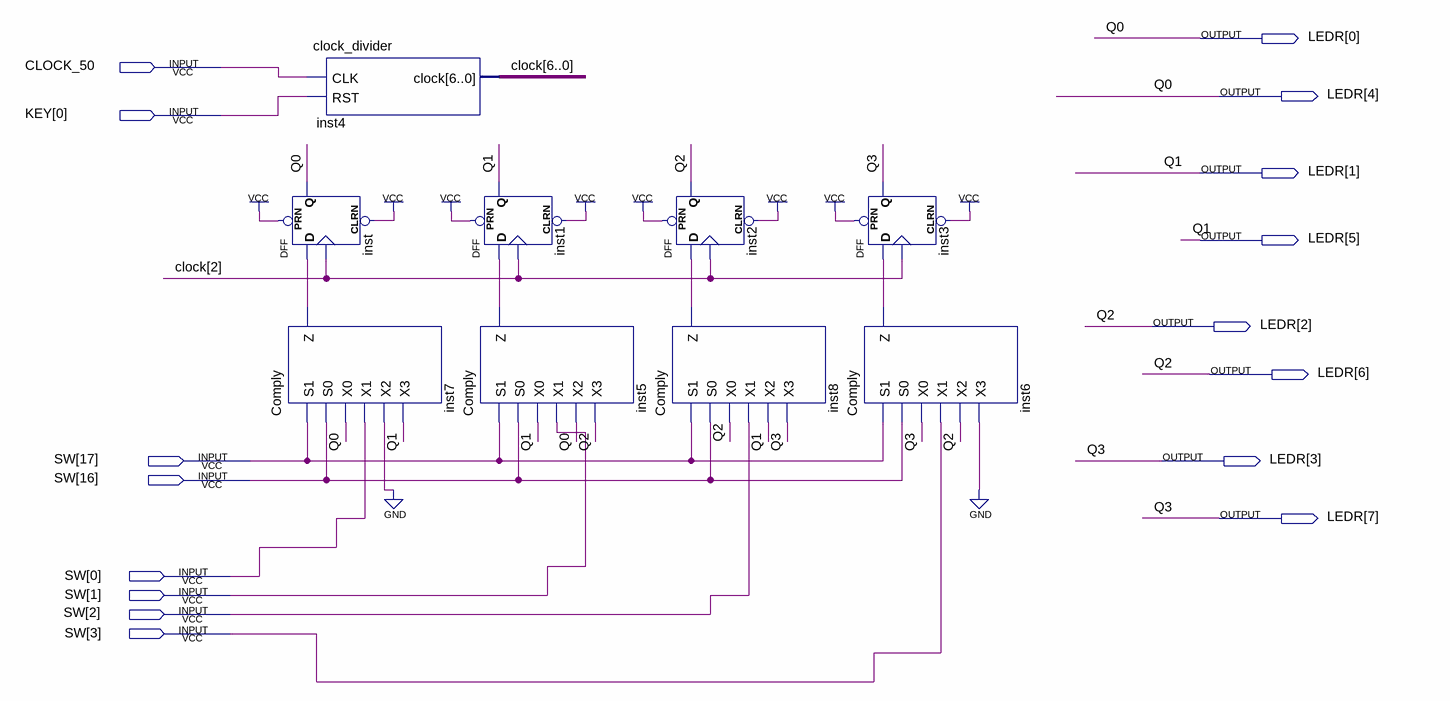
[diagram p0: schematic sheet]
// Quartus schematic Lab07.bdf as structural Verilog: 9 symbols, 16 pins
module Lab07 (
  input  CLOCK_50,
  input  [0:0] KEY,
  input  [17:0] SW,
  output [7:0] LEDR
);

  wire inst5_z, inst6_z, inst7_z, inst8_z;
  wire [6:0] clock;

  DFF inst (.CLRN(1'b1), .CLK(clock[2]), .D(inst7_z), .PRN(1'b1), .Q(LEDR[4]));
  Comply inst7 (.S1(SW[17]), .S0(SW[16]), .X0(LEDR[4]), .X1(SW[0]), .X2(1'b0), .X3(LEDR[5]), .Z(inst7_z));
  clock_divider inst4 (.CLK(CLOCK_50), .RST(KEY[0]), .clock(clock));
  DFF inst1 (.CLRN(1'b1), .CLK(clock[2]), .D(inst5_z), .PRN(1'b1), .Q(LEDR[5]));
  Comply inst5 (.S1(SW[17]), .S0(SW[16]), .X0(LEDR[5]), .X1(SW[1]), .X2(LEDR[4]), .X3(LEDR[6]), .Z(inst5_z));
  DFF inst2 (.CLRN(1'b1), .CLK(clock[2]), .D(inst8_z), .PRN(1'b1), .Q(LEDR[6]));
  Comply inst8 (.S1(SW[17]), .S0(SW[16]), .X0(LEDR[6]), .X1(SW[2]), .X2(LEDR[5]), .X3(LEDR[7]), .Z(inst8_z));
  DFF inst3 (.CLRN(1'b1), .CLK(clock[2]), .D(inst6_z), .PRN(1'b1), .Q(LEDR[7]));
  Comply inst6 (.S1(SW[17]), .S0(SW[16]), .X0(LEDR[7]), .X1(SW[3]), .X2(LEDR[6]), .X3(1'b0), .Z(inst6_z));

  assign LEDR[3:0] = LEDR[7:4];

  // Other names for the same wires on the sheet: Q0 = LEDR[4]; Q1 = LEDR[5]; Q2 = LEDR[6]; Q3 = LEDR[7]
endmodule
